# Altium schematic sheet Sheet1.SchDoc
size 431 x 279 mm; SheetNumber: 1; SheetTotal: 1; ENG_APP_DATE: --/--/--; DSN_APP_DATE: --/--/--; CHK_APP_DATE: --/--/--
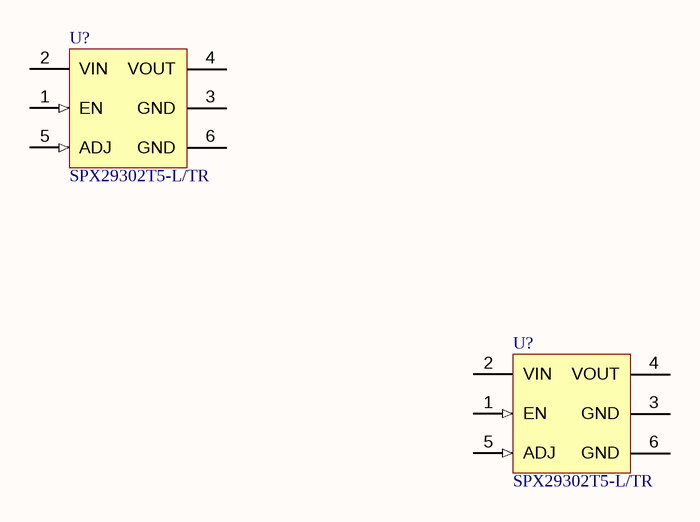
[diagram p0: Sheet1.SchDoc]

## Parts
(Parts that share a designator on the sheet are numbered #1, #2 ... from top to bottom, then left to right.)
U?#1  SPX29302T5-L/TR  [EXAR-TO263-5_M]
U?#2  SPX29302T5-L/TR  [EXAR-TO263-5_M]

## Nets

Not connected (* = marked no-connect by the designer): U?#1 1(EN) 2(VIN) 3(GND) 4(VOUT) 5(ADJ) 6(GND); U?#2 1(EN) 2(VIN) 3(GND) 4(VOUT) 5(ADJ) 6(GND)

## Notes on the sheet
- DWG. NO.
- REV.
- SHT.
- THIS DOCUMENT AND THE DATA DISCLOSED HEREIN OR HEREWITH IS THE PROPERTY OF ALTIUM LIMITED AND MAY BE FREELY DISTRIBUTED IN WHOLE. NO RIGHTS ARE RESERVED OR EXPRESS OR IMPLIED WARANTEE GIVEN.
- REVISION
- DESCRIPTION
- DATE
- APPROVED
- ENG:
- APPROVALS
- PROJECT
- DSN:
- CHK:
- REFERENCE DOCUMENTS
- PROJECT REVISION:
- TITLE
- DOCUMENT REVISION:
- DESIGN ITEM:
- BOM:
- FAB DWG:
- PCB DWG:
- ASSY DWG:
- SCALE:
- SIZE
- B
- CAGE CODE
- FILE NAME
- DWG NO.
- SHEET
- OF
- REV

## Library data of the parts
U?#1 U?#2 = CMP-019-00033-3: Highly Accurate Voltage Regulator, 3 A, 1.25 to 16 V, -40 to 125 degC, 6-Pin DPAK, RoHS, Tape and Reel; Manufacturer: Exar Corporation; Pins: 6; Manufacturer URL: https://www.exar.com/; Package Description: 6-Pin Transistor Outline, Body 9.015 x 10.16 mm, Pitch 1.7 mm; Datasheet URL: https://www.exar.com/content/document.ashx?id=1328; Mounting Technology: SM; Max Operating Temperature: 125°C; RoHS Compliant: True; Package Reference: DPAK; Packaging: TapeandReel; Datasheet Version: Rev. 2.1.0, 10/2011; Min Operating Temperature: -40°C; Voltage: 1.25to16V; Case/Package: DPAK